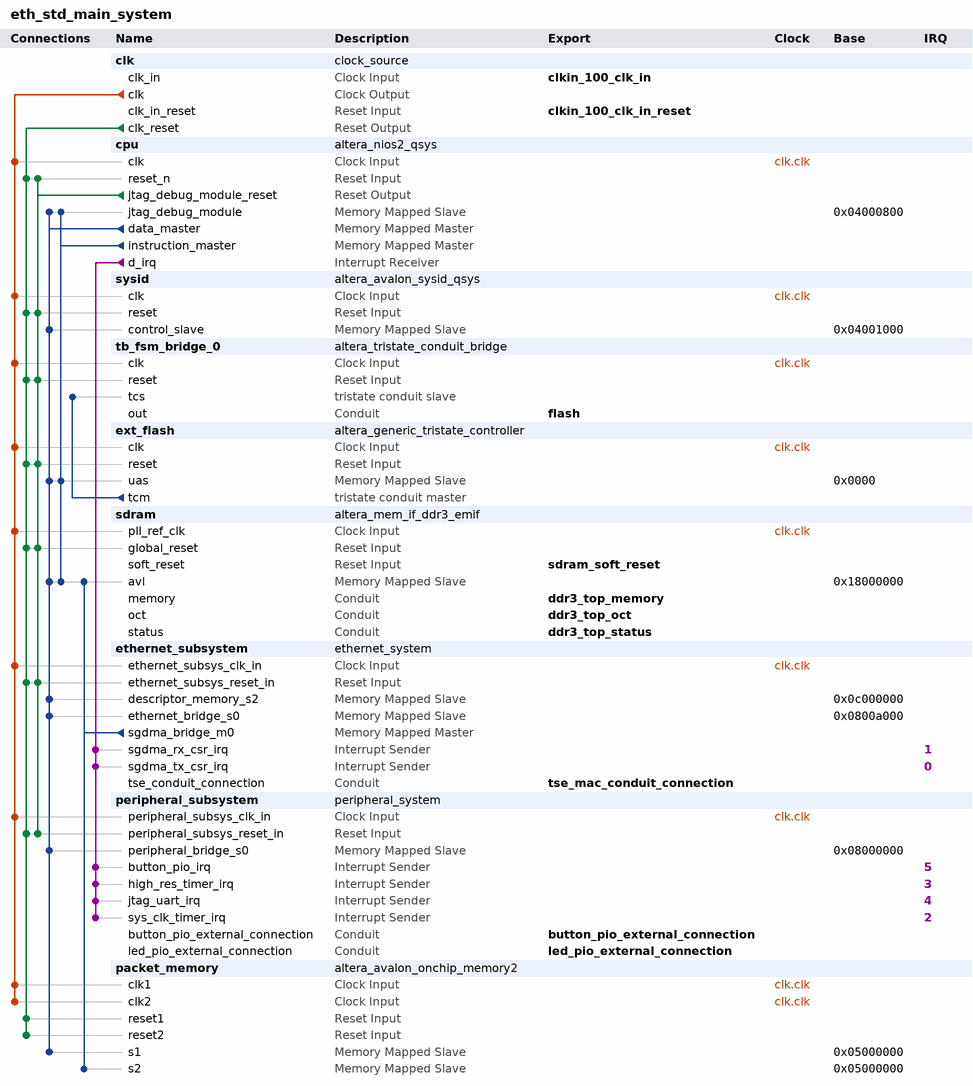
[diagram p0: system contents]
# Platform Designer (Qsys) system eth_std_main_system, Stratix IV EP4SGX230KF40C2
# Parameters at their usual value, and those the tool derives, are not listed.
package require -exact qsys 12.1
create_system eth_std_main_system
set_project_property DEVICE_FAMILY {Stratix IV}
set_project_property DEVICE EP4SGX230KF40C2

add_instance clk clock_source 12.1
set_instance_parameter_value clk clockFrequency 100000000

add_instance cpu altera_nios2_qsys 12.1
set_instance_parameter_value cpu muldiv_divider true
set_instance_parameter_value cpu mmu_autoAssignTlbPtrSz false
set_instance_parameter_value cpu manuallyAssignCpuID false
set_instance_parameter_value cpu exceptionOffset 288
set_instance_parameter_value cpu resetSlave ext_flash.uas
set_instance_parameter_value cpu exceptionSlave sdram.avl
set_instance_parameter_value cpu breakSlave cpu.jtag_debug_module
set_instance_parameter_value cpu muldiv_multiplierType DSPBlock
set_instance_parameter_value cpu impl Fast
set_instance_parameter_value cpu icache_size 32768
set_instance_parameter_value cpu dcache_size 32768

add_instance sysid altera_avalon_sysid_qsys 12.1
set_instance_parameter_value sysid id 0

add_instance tb_fsm_bridge_0 altera_tristate_conduit_bridge 12.1

add_instance ext_flash altera_generic_tristate_controller 12.1
set_instance_parameter_value ext_flash TCM_ADDRESS_W 26
set_instance_parameter_value ext_flash TCM_DATA_W 16
set_instance_parameter_value ext_flash TCM_BYTEENABLE_W 2
set_instance_parameter_value ext_flash TCM_READ_WAIT 140
set_instance_parameter_value ext_flash TCM_WRITE_WAIT 140
set_instance_parameter_value ext_flash TCM_SETUP_WAIT 25
set_instance_parameter_value ext_flash TCM_DATA_HOLD 20
set_instance_parameter_value ext_flash TCM_MAX_PENDING_READ_TRANSACTIONS 3
set_instance_parameter_value ext_flash TCM_TURNAROUND_TIME 2
set_instance_parameter_value ext_flash TCM_TIMING_UNITS 0
set_instance_parameter_value ext_flash TCM_READLATENCY 2
set_instance_parameter_value ext_flash TCM_SYMBOLS_PER_WORD 2
set_instance_parameter_value ext_flash USE_READ 1
set_instance_parameter_value ext_flash USE_BEGINTRANSFER 0
set_instance_parameter_value ext_flash USE_BYTEENABLE 0
set_instance_parameter_value ext_flash USE_OUTPUTENABLE 0
set_instance_parameter_value ext_flash ACTIVE_LOW_READ 1
set_instance_parameter_value ext_flash ACTIVE_LOW_BYTEENABLE 0
set_instance_parameter_value ext_flash ACTIVE_LOW_OUTPUTENABLE 0
set_instance_parameter_value ext_flash ACTIVE_LOW_BEGINTRANSFER 0
set_instance_parameter_value ext_flash CHIPSELECT_THROUGH_READLATENCY 0
set_instance_parameter_value ext_flash MODULE_ASSIGNMENT_KEYS embeddedsw.configuration.hwClassnameDriverSupportList,embeddedsw.configuration.hwClassnameDriverSupportDefault,embeddedsw.CMacro.SETUP_VALUE,embeddedsw.CMacro.WAIT_VALUE,embeddedsw.CMacro.HOLD_VALUE,embeddedsw.CMacro.TIMING_UNITS,embeddedsw.CMacro.SIZE,embeddedsw.memoryInfo.MEM_INIT_DATA_WIDTH,embeddedsw.memoryInfo.HAS_BYTE_LANE,embeddedsw.memoryInfo.IS_FLASH,embeddedsw.memoryInfo.GENERATE_DAT_SYM,embeddedsw.memoryInfo.GENERATE_FLASH,embeddedsw.memoryInfo.DAT_SYM_INSTALL_DIR,embeddedsw.memoryInfo.FLASH_INSTALL_DIR
set_instance_parameter_value ext_flash MODULE_ASSIGNMENT_VALUES {altera_avalon_lan91c111:altera_avalon_cfi_flash,altera_avalon_cfi_flash,25,140,20,"ns",67108864u,16,1,1,1,1,SIM_DIR,APP_DIR}
set_instance_parameter_value ext_flash INTERFACE_ASSIGNMENT_KEYS embeddedsw.configuration.isFlash,embeddedsw.configuration.isMemoryDevice,embeddedsw.configuration.isNonVolatileStorage
set_instance_parameter_value ext_flash INTERFACE_ASSIGNMENT_VALUES 1,1,1

add_instance sdram altera_mem_if_ddr3_emif 12.1
set_instance_parameter_value sdram MEM_VENDOR Micron
set_instance_parameter_value sdram MEM_FORMAT DISCRETE
set_instance_parameter_value sdram MEM_CLK_FREQ_MAX 666.667
set_instance_parameter_value sdram MEM_ROW_ADDR_WIDTH 13
set_instance_parameter_value sdram MEM_COL_ADDR_WIDTH 10
set_instance_parameter_value sdram MEM_DQ_WIDTH 16
set_instance_parameter_value sdram MEM_BANKADDR_WIDTH 3
set_instance_parameter_value sdram MEM_RTT_NOM RZQ/4
set_instance_parameter_value sdram MEM_WTCL 6
set_instance_parameter_value sdram MEM_TCL 6
set_instance_parameter_value sdram TIMING_TIS 190
set_instance_parameter_value sdram TIMING_TIH 140
set_instance_parameter_value sdram TIMING_TDS 30
set_instance_parameter_value sdram TIMING_TDH 65
set_instance_parameter_value sdram TIMING_TDQSQ 125
set_instance_parameter_value sdram TIMING_TDQSCK 255
set_instance_parameter_value sdram TIMING_TDQSS 0.25
set_instance_parameter_value sdram TIMING_TQSH 0.4
set_instance_parameter_value sdram TIMING_TDSH 0.2
set_instance_parameter_value sdram TIMING_TDSS 0.2
set_instance_parameter_value sdram MEM_TRAS_NS 36.0
set_instance_parameter_value sdram MEM_TRCD_NS 13.5
set_instance_parameter_value sdram MEM_TRP_NS 13.5
set_instance_parameter_value sdram MEM_TRFC_NS 110.0
set_instance_parameter_value sdram MEM_TWTR 4
set_instance_parameter_value sdram MEM_TFAW_NS 30.0
set_instance_parameter_value sdram MEM_TRRD_NS 6.0
set_instance_parameter_value sdram MEM_TRTP_NS 7.5
set_instance_parameter_value sdram RATE Half
set_instance_parameter_value sdram MEM_CLK_FREQ 300.0
set_instance_parameter_value sdram SPEED_GRADE 2
set_instance_parameter_value sdram HARD_EMIF false
set_instance_parameter_value sdram POWER_OF_TWO_BUS true
set_instance_parameter_value sdram SOPC_COMPAT_RESET true
set_instance_parameter_value sdram AVL_MAX_SIZE 16
set_instance_parameter_value sdram CFG_REORDER_DATA false
set_instance_parameter_value sdram PRIORITY_PORT 1,1,1,1,1,1
set_instance_parameter_value sdram CPORT_TYPE_PORT Bidirectional,Bidirectional,Bidirectional,Bidirectional,Bidirectional,Bidirectional
set_instance_parameter_value sdram REF_CLK_FREQ 100.0
set_instance_parameter_value sdram DEFAULT_FAST_SIM_MODEL true
set_instance_parameter_value sdram EXPORT_AFI_HALF_CLK false
set_instance_parameter_value sdram ADVANCED_CK_PHASES true
set_instance_parameter_value sdram PLL_LOCATION Top_Bottom
set_instance_parameter_value sdram SKIP_MEM_INIT false
set_instance_parameter_value sdram CALIBRATION_MODE Full
set_instance_parameter_value sdram USER_DEBUG_LEVEL 0
set_instance_parameter_value sdram TIMING_BOARD_DERATE_METHOD SLEW_RATE
set_instance_parameter_value sdram TIMING_BOARD_MAX_CK_DELAY 0.6
set_instance_parameter_value sdram TIMING_BOARD_MAX_DQS_DELAY 0.6
set_instance_parameter_value sdram TIMING_BOARD_SKEW_CKDQS_DIMM_MIN -0.079
set_instance_parameter_value sdram TIMING_BOARD_SKEW_CKDQS_DIMM_MAX -0.021
set_instance_parameter_value sdram TIMING_BOARD_SKEW_WITHIN_DQS 0.017
set_instance_parameter_value sdram TIMING_BOARD_SKEW_BETWEEN_DQS 0.058
set_instance_parameter_value sdram TIMING_BOARD_DQ_TO_DQS_SKEW -0.0090
set_instance_parameter_value sdram TIMING_BOARD_AC_SKEW 0.084
set_instance_parameter_value sdram TIMING_BOARD_AC_TO_CK_SKEW 0.025
set_instance_parameter_value sdram ENABLE_ABS_RAM_MEM_INIT true

add_instance ethernet_subsystem ethernet_system 1.0

add_instance peripheral_subsystem peripheral_system 1.0

add_instance packet_memory altera_avalon_onchip_memory2 12.1
set_instance_parameter_value packet_memory dataWidth 32
set_instance_parameter_value packet_memory dualPort true
set_instance_parameter_value packet_memory initMemContent true
set_instance_parameter_value packet_memory initializationFileName packet_memory
set_instance_parameter_value packet_memory memorySize 65536

# connections
add_connection clk.clk cpu.clk clock
add_connection clk.clk ethernet_subsystem.ethernet_subsys_clk_in clock
add_connection clk.clk ext_flash.clk clock
add_connection clk.clk packet_memory.clk1 clock
add_connection clk.clk packet_memory.clk2 clock
add_connection clk.clk peripheral_subsystem.peripheral_subsys_clk_in clock
add_connection clk.clk sdram.pll_ref_clk clock
add_connection clk.clk sysid.clk clock
add_connection clk.clk tb_fsm_bridge_0.clk clock
add_connection clk.clk_reset cpu.reset_n reset
add_connection clk.clk_reset ethernet_subsystem.ethernet_subsys_reset_in reset
add_connection clk.clk_reset ext_flash.reset reset
add_connection clk.clk_reset packet_memory.reset1 reset
add_connection clk.clk_reset packet_memory.reset2 reset
add_connection clk.clk_reset peripheral_subsystem.peripheral_subsys_reset_in reset
add_connection clk.clk_reset sdram.global_reset reset
add_connection clk.clk_reset sysid.reset reset
add_connection clk.clk_reset tb_fsm_bridge_0.reset reset
add_connection cpu.jtag_debug_module_reset cpu.reset_n reset
add_connection cpu.jtag_debug_module_reset ethernet_subsystem.ethernet_subsys_reset_in reset
add_connection cpu.jtag_debug_module_reset ext_flash.reset reset
add_connection cpu.jtag_debug_module_reset peripheral_subsystem.peripheral_subsys_reset_in reset
add_connection cpu.jtag_debug_module_reset sdram.global_reset reset
add_connection cpu.jtag_debug_module_reset sysid.reset reset
add_connection cpu.jtag_debug_module_reset tb_fsm_bridge_0.reset reset
add_connection cpu.data_master cpu.jtag_debug_module avalon
set_connection_parameter_value cpu.data_master/cpu.jtag_debug_module baseAddress 0x04000800
add_connection cpu.data_master ethernet_subsystem.descriptor_memory_s2 avalon
set_connection_parameter_value cpu.data_master/ethernet_subsystem.descriptor_memory_s2 baseAddress 0x0c000000
add_connection cpu.data_master ethernet_subsystem.ethernet_bridge_s0 avalon
set_connection_parameter_value cpu.data_master/ethernet_subsystem.ethernet_bridge_s0 baseAddress 0x0800a000
add_connection cpu.data_master ext_flash.uas avalon
set_connection_parameter_value cpu.data_master/ext_flash.uas baseAddress 0x0000
add_connection cpu.data_master packet_memory.s1 avalon
set_connection_parameter_value cpu.data_master/packet_memory.s1 baseAddress 0x05000000
add_connection cpu.data_master peripheral_subsystem.peripheral_bridge_s0 avalon
set_connection_parameter_value cpu.data_master/peripheral_subsystem.peripheral_bridge_s0 baseAddress 0x08000000
add_connection cpu.data_master sdram.avl avalon
set_connection_parameter_value cpu.data_master/sdram.avl baseAddress 0x18000000
add_connection cpu.data_master sysid.control_slave avalon
set_connection_parameter_value cpu.data_master/sysid.control_slave baseAddress 0x04001000
add_connection cpu.instruction_master cpu.jtag_debug_module avalon
set_connection_parameter_value cpu.instruction_master/cpu.jtag_debug_module baseAddress 0x04000800
add_connection cpu.instruction_master ext_flash.uas avalon
set_connection_parameter_value cpu.instruction_master/ext_flash.uas baseAddress 0x0000
add_connection cpu.instruction_master sdram.avl avalon
set_connection_parameter_value cpu.instruction_master/sdram.avl baseAddress 0x18000000
add_connection ethernet_subsystem.sgdma_bridge_m0 packet_memory.s2 avalon
set_connection_parameter_value ethernet_subsystem.sgdma_bridge_m0/packet_memory.s2 baseAddress 0x05000000
add_connection ethernet_subsystem.sgdma_bridge_m0 sdram.avl avalon
set_connection_parameter_value ethernet_subsystem.sgdma_bridge_m0/sdram.avl baseAddress 0x18000000
add_connection cpu.d_irq ethernet_subsystem.sgdma_rx_csr_irq interrupt
set_connection_parameter_value cpu.d_irq/ethernet_subsystem.sgdma_rx_csr_irq irqNumber 1
add_connection cpu.d_irq ethernet_subsystem.sgdma_tx_csr_irq interrupt
set_connection_parameter_value cpu.d_irq/ethernet_subsystem.sgdma_tx_csr_irq irqNumber 0
add_connection cpu.d_irq peripheral_subsystem.button_pio_irq interrupt
set_connection_parameter_value cpu.d_irq/peripheral_subsystem.button_pio_irq irqNumber 5
add_connection cpu.d_irq peripheral_subsystem.high_res_timer_irq interrupt
set_connection_parameter_value cpu.d_irq/peripheral_subsystem.high_res_timer_irq irqNumber 3
add_connection cpu.d_irq peripheral_subsystem.jtag_uart_irq interrupt
set_connection_parameter_value cpu.d_irq/peripheral_subsystem.jtag_uart_irq irqNumber 4
add_connection cpu.d_irq peripheral_subsystem.sys_clk_timer_irq interrupt
set_connection_parameter_value cpu.d_irq/peripheral_subsystem.sys_clk_timer_irq irqNumber 2
add_connection ext_flash.tcm tb_fsm_bridge_0.tcs tristate_conduit

# exported interfaces
add_interface flash conduit end
set_interface_property flash EXPORT_OF tb_fsm_bridge_0.out
add_interface clkin_100_clk_in clock sink
set_interface_property clkin_100_clk_in EXPORT_OF clk.clk_in
add_interface clkin_100_clk_in_reset reset sink
set_interface_property clkin_100_clk_in_reset EXPORT_OF clk.clk_in_reset
add_interface tse_mac_conduit_connection conduit end
set_interface_property tse_mac_conduit_connection EXPORT_OF ethernet_subsystem.tse_conduit_connection
add_interface led_pio_external_connection conduit end
set_interface_property led_pio_external_connection EXPORT_OF peripheral_subsystem.led_pio_external_connection
add_interface button_pio_external_connection conduit end
set_interface_property button_pio_external_connection EXPORT_OF peripheral_subsystem.button_pio_external_connection
add_interface ddr3_top_memory conduit end
set_interface_property ddr3_top_memory EXPORT_OF sdram.memory
add_interface ddr3_top_status conduit end
set_interface_property ddr3_top_status EXPORT_OF sdram.status
add_interface ddr3_top_oct conduit end
set_interface_property ddr3_top_oct EXPORT_OF sdram.oct
add_interface sdram_soft_reset reset sink
set_interface_property sdram_soft_reset EXPORT_OF sdram.soft_reset

save_system eth_std_main_system.qsys
